# EasyEDA Pro project ProDoc_Home_Automation_Device_2026-02-15.epro

# Schematic Home_Automation_Device

## Sheets
1 Main: Board Name: Home_Automation_Device; Create Date: 2026-02-12; Page Name: Main; Project Name: Home_automation_device; Schematic Name: Home_Automation_Device; Update Date: 2026-02-14; Drawn: SvdM 20260214; Page Size: A4; Reviewed: SvdM 20260214; Version: V1.0
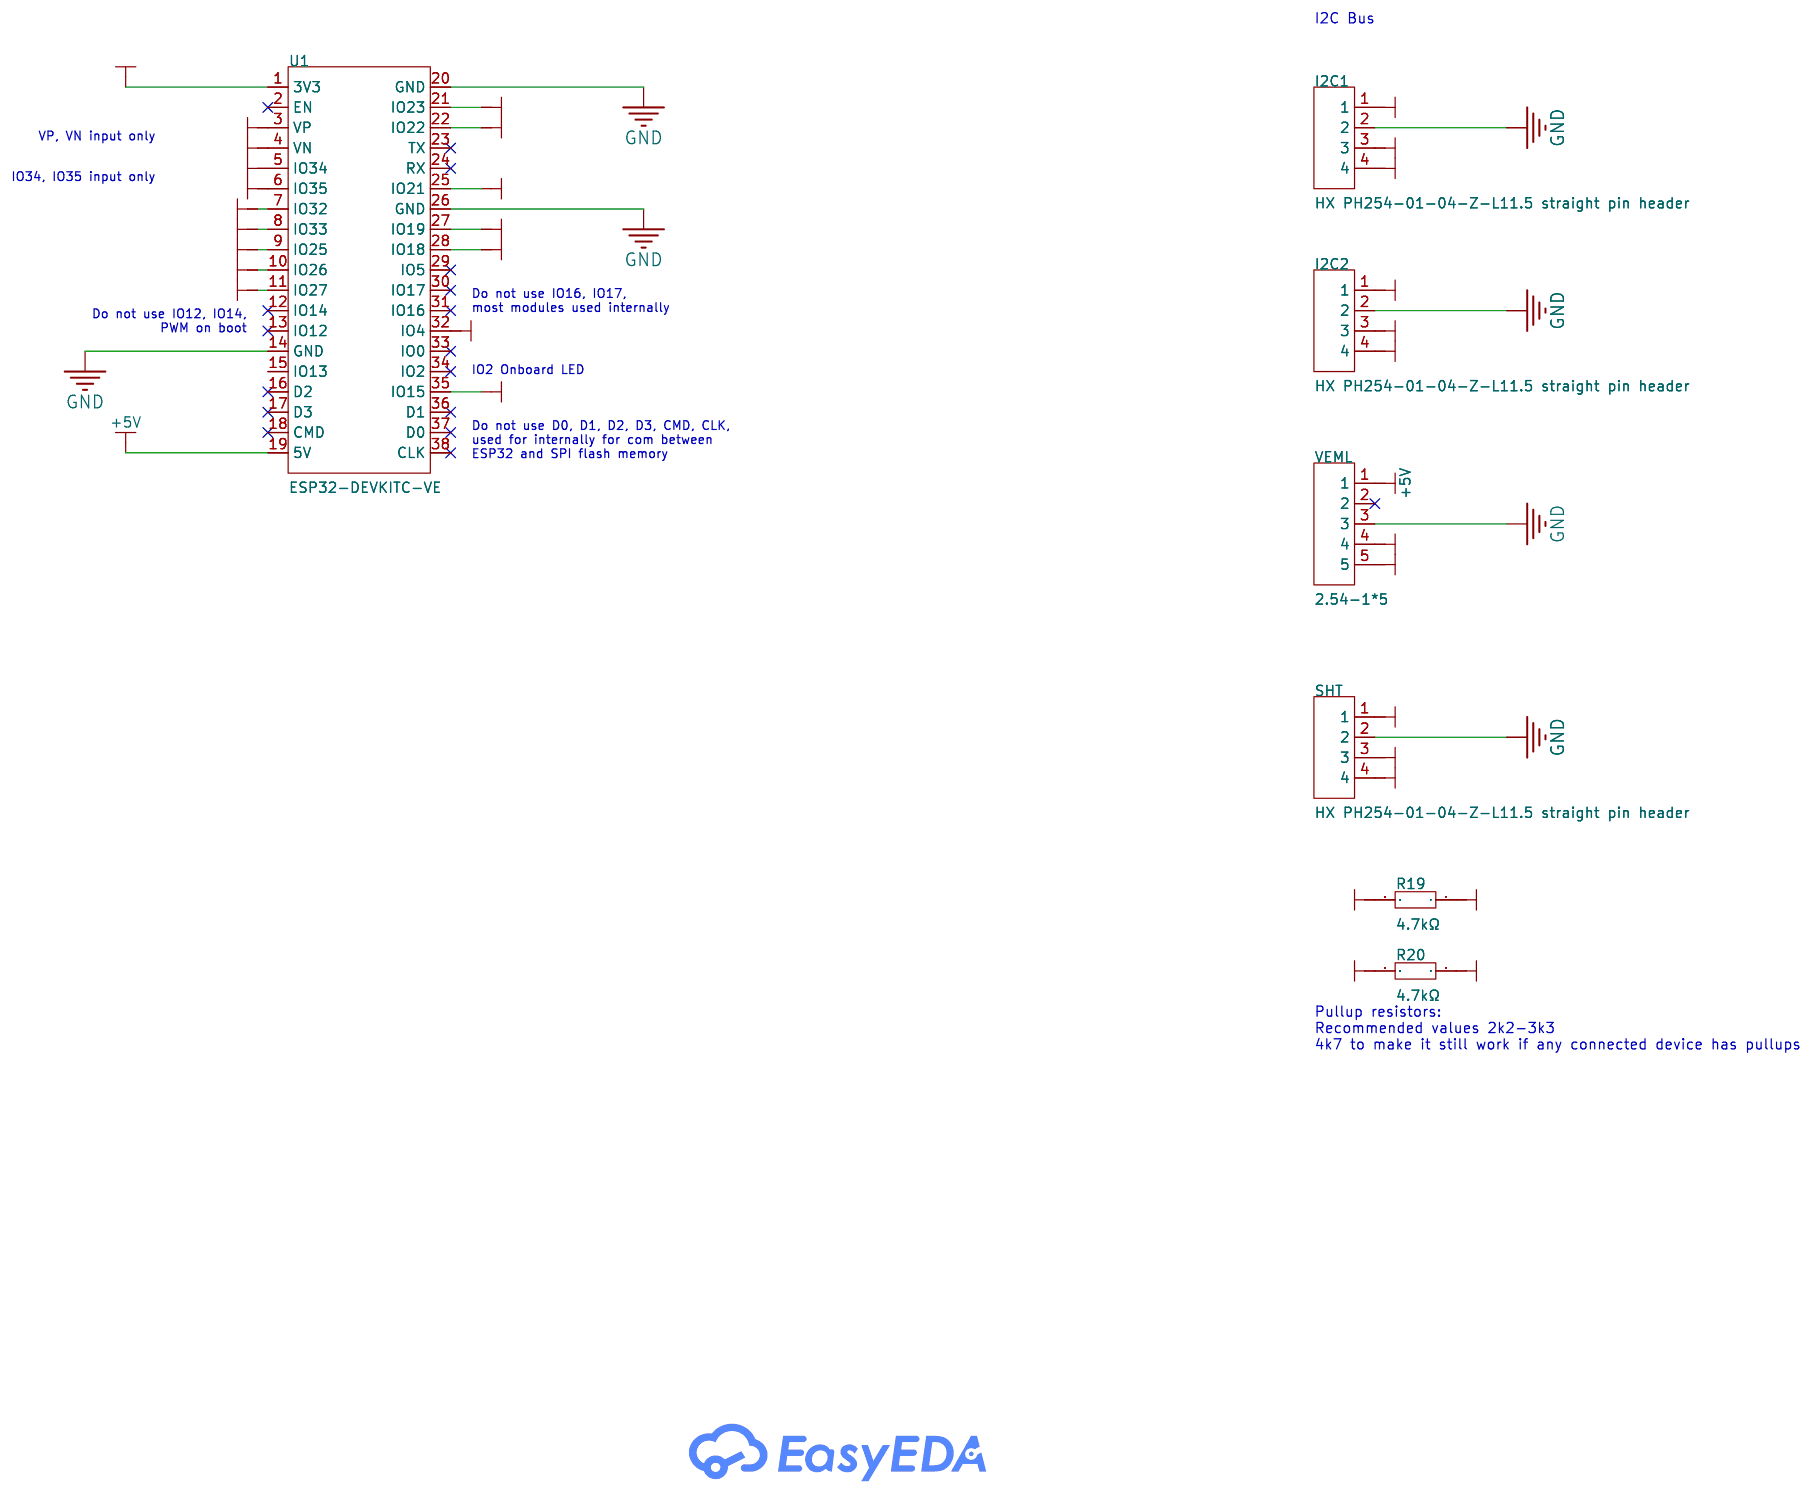
[diagram p0: Main]
2 Input and power: Page Name: Input and power; Update Date: 2026-02-15
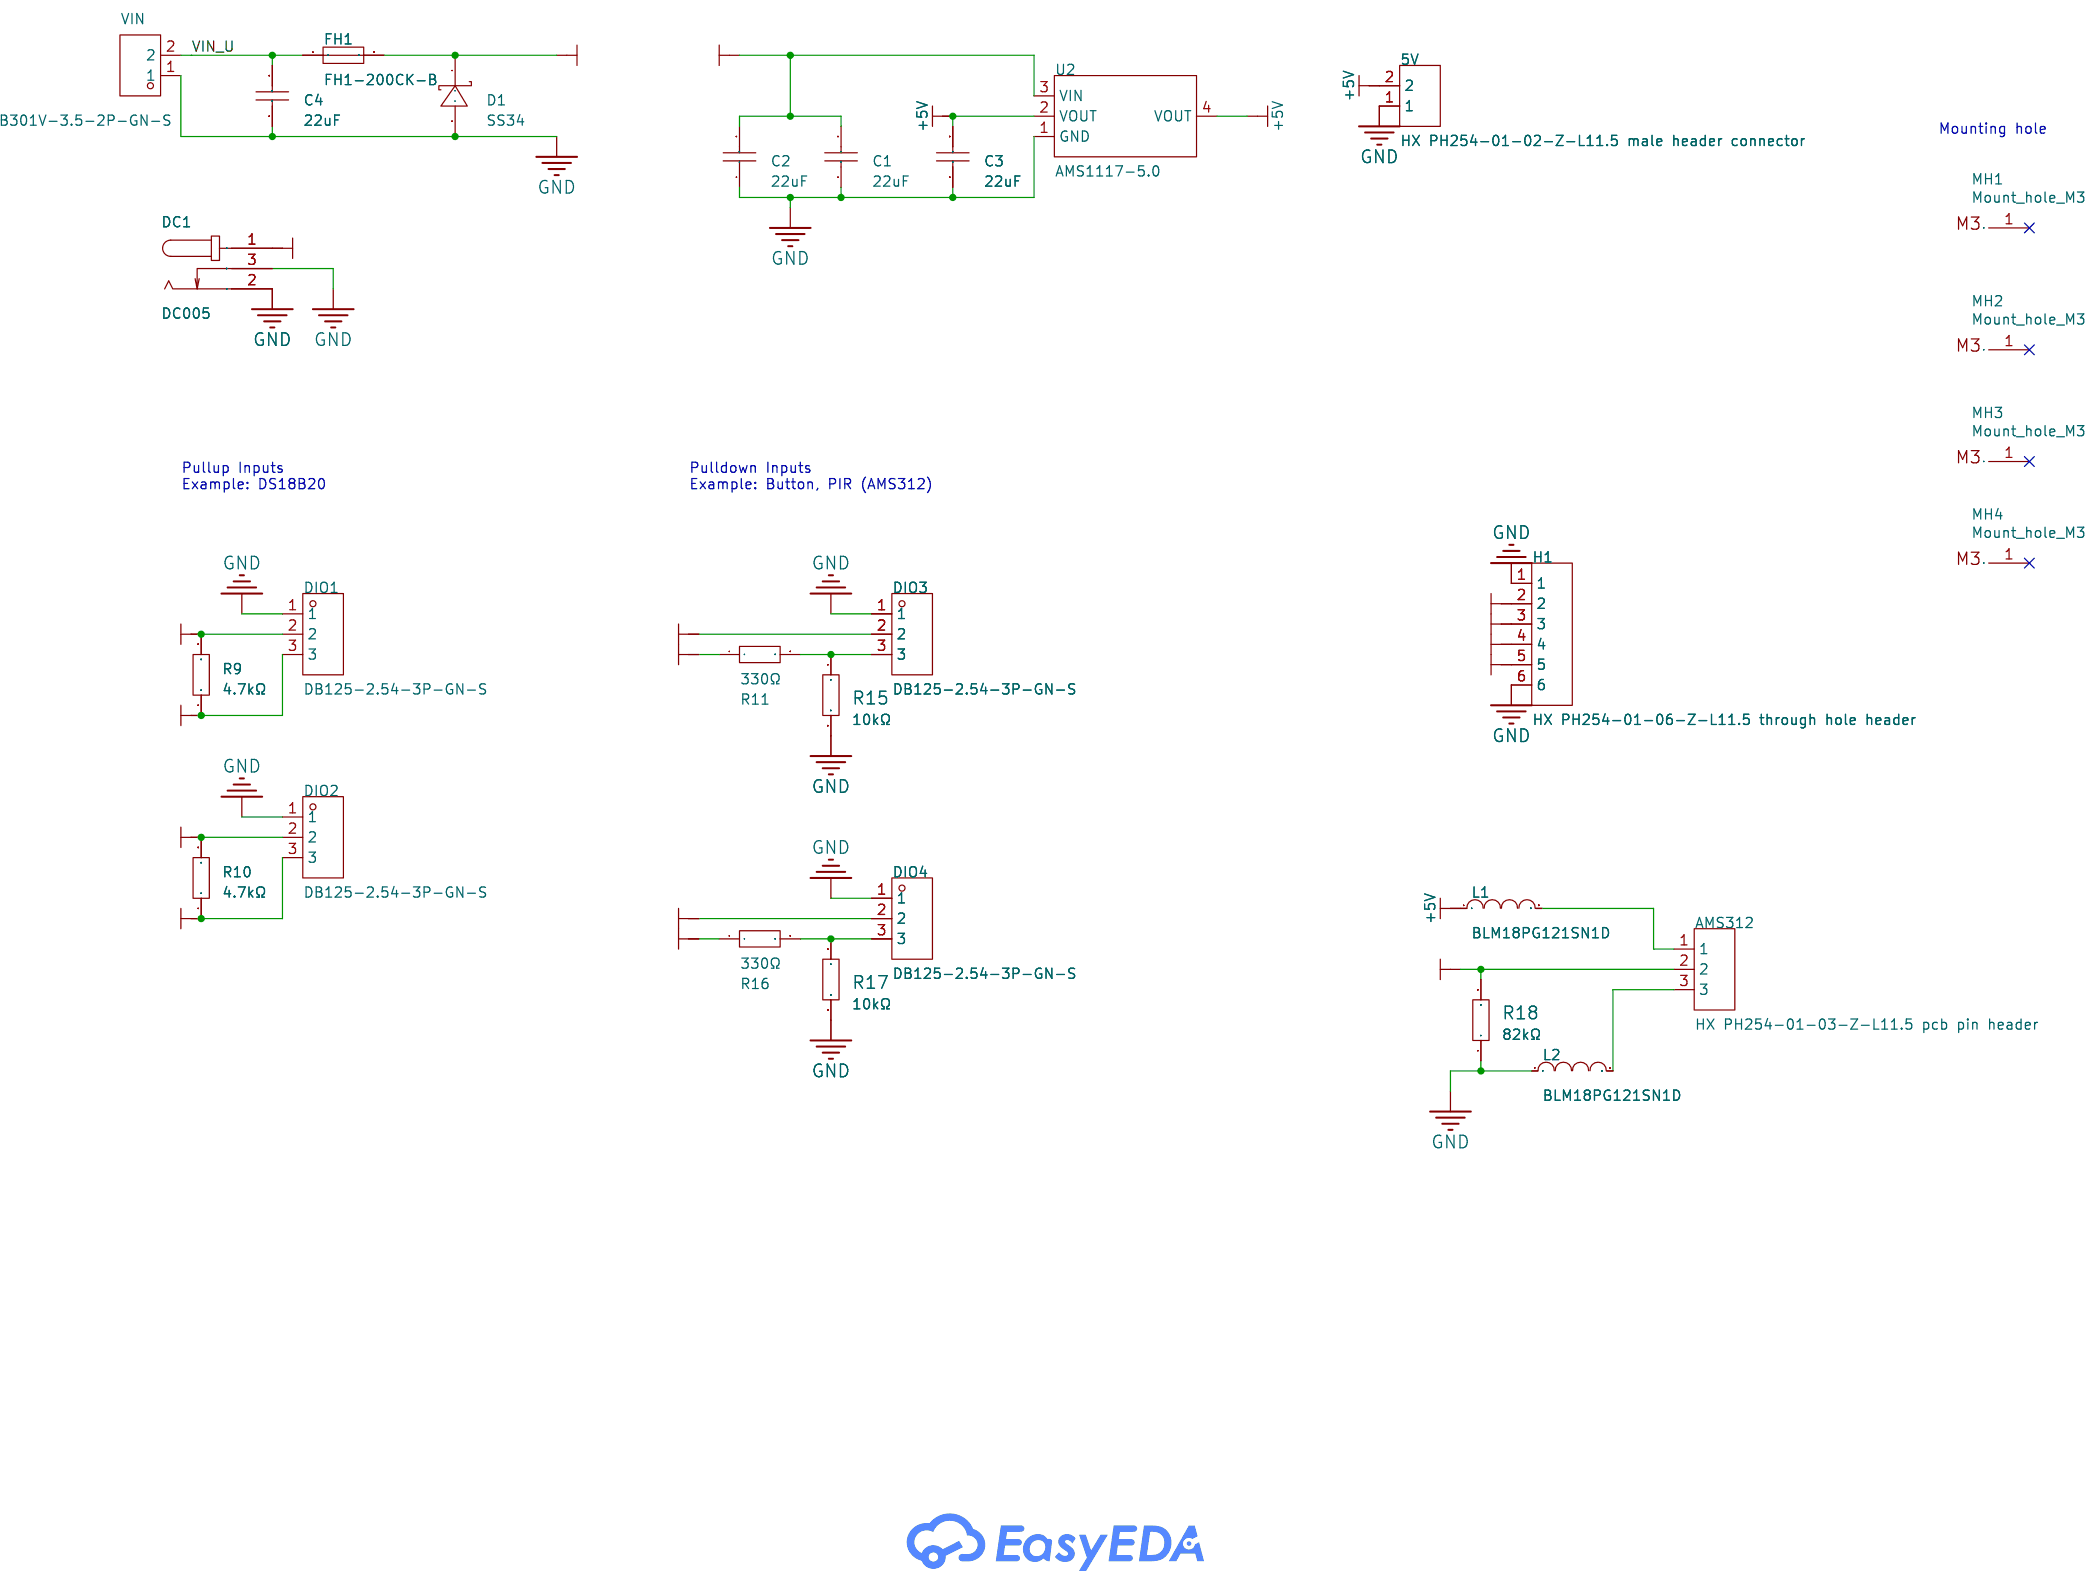
[diagram p1: Input and power]
3 Outputs: Page Name: Outputs; Update Date: 2026-02-15
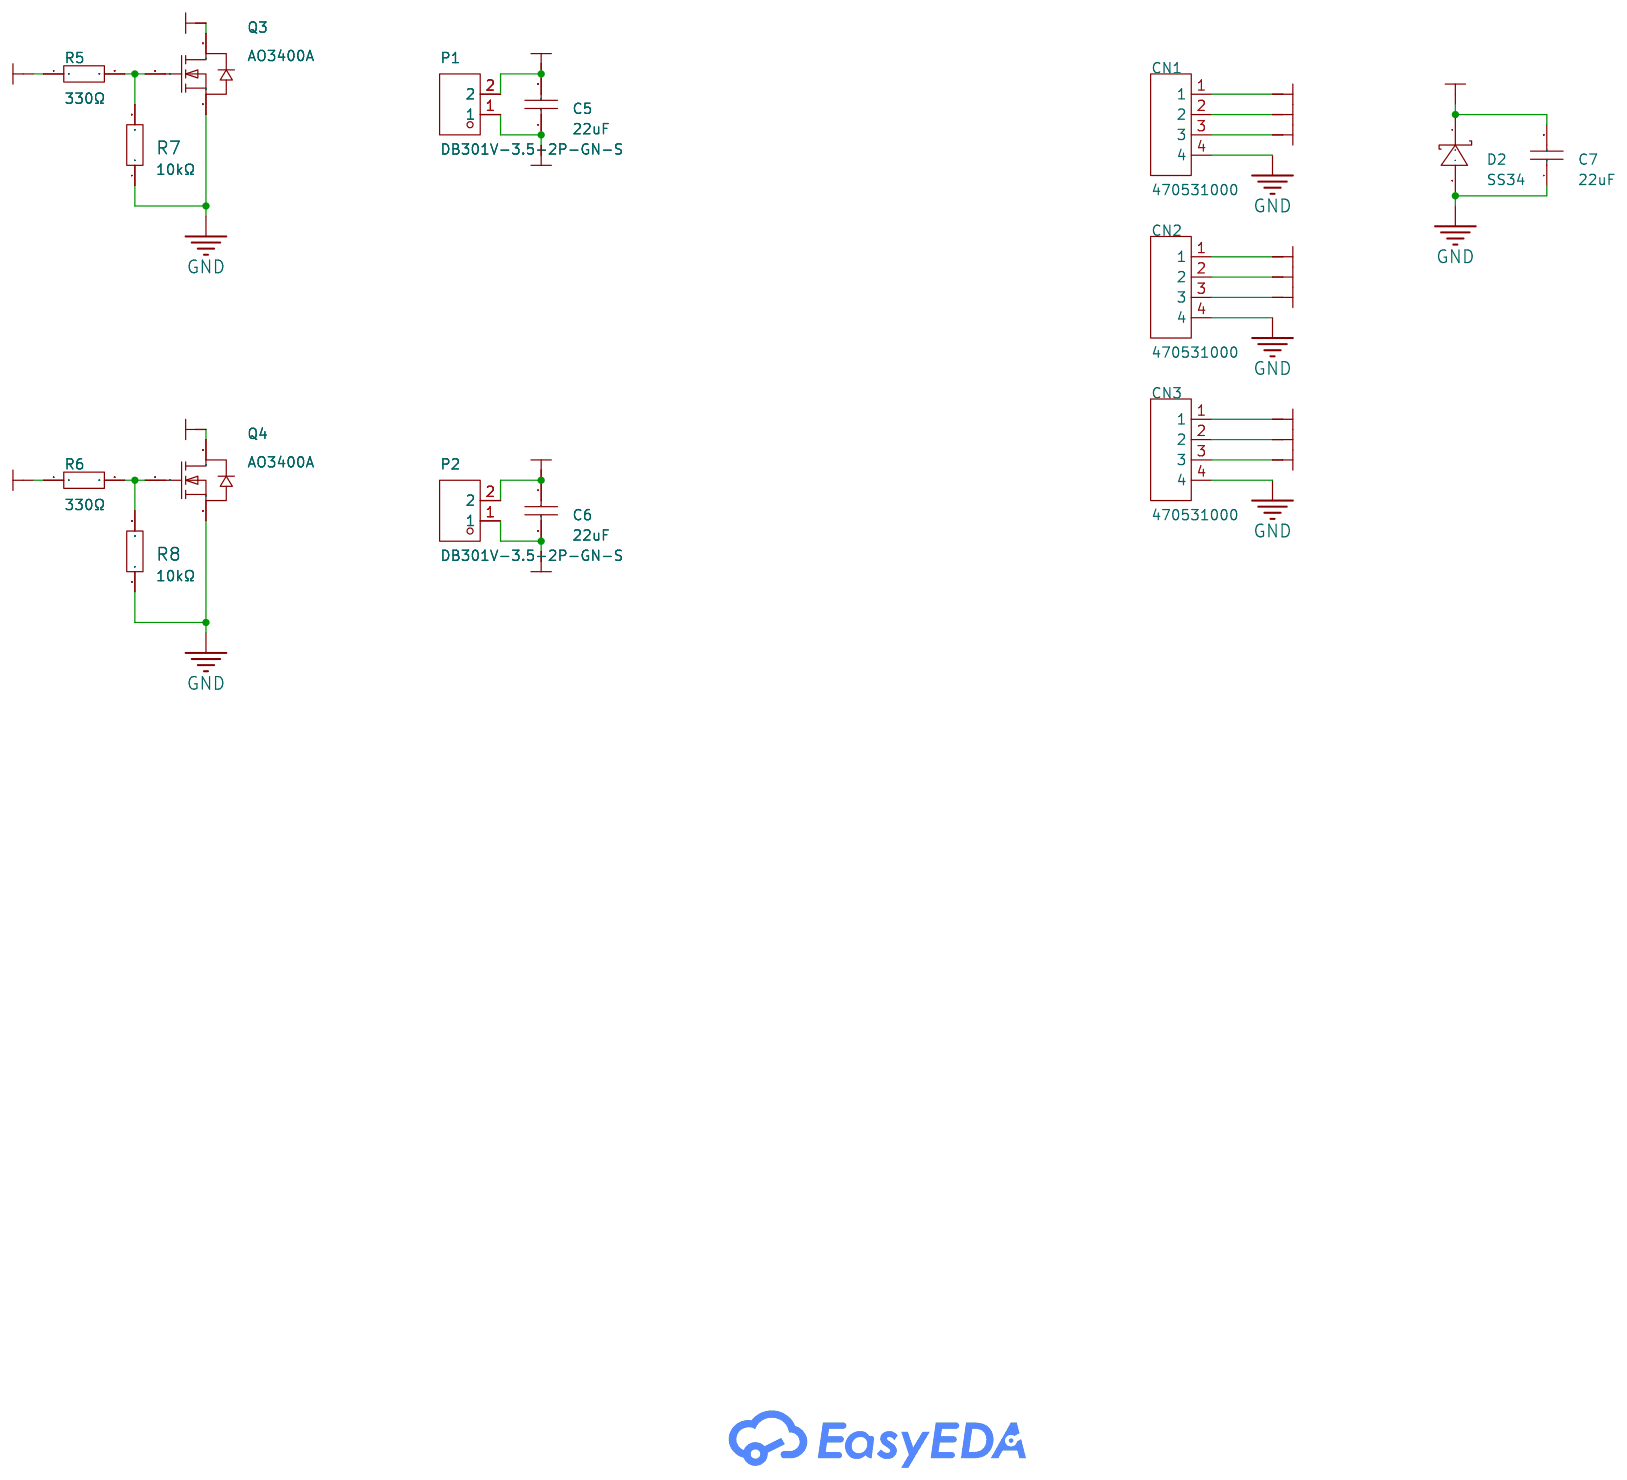
[diagram p2: Outputs]

## Parts
sheet Input and power
5V  HX PH254-01-02-Z-L11.5 male header connector  [HDR-TH_2P-P2.54-V-M]  (no BOM)
AMS312  HX PH254-01-03-Z-L11.5 pcb pin header  [HDR-TH_3P-P2.54-V-M-1]  (no BOM)
C1  22uF  [C1206]
C2  22uF  [C1206]
C3  22uF  [C1206]
C4  22uF  [C1206]
D1  SS34  [SMA_L4.3-W2.6-LS5.2-RD]
DC1  DC005  [DC-IN-TH_DC005]
DIO1  DB125-2.54-3P-GN-S  [CONN-TH_DB125-2.54-3P-GN]
DIO2  DB125-2.54-3P-GN-S  [CONN-TH_DB125-2.54-3P-GN]
DIO3  DB125-2.54-3P-GN-S  [CONN-TH_DB125-2.54-3P-GN]
DIO4  DB125-2.54-3P-GN-S  [CONN-TH_DB125-2.54-3P-GN]
FH1  FH1-200CK-B  [FUSE-TH_L24.8-W9.8-P22.60]
H1  HX PH254-01-06-Z-L11.5 through hole header  [HDR-TH_6P-P2.54-V-M]  (no BOM)
L1  BLM18PG121SN1D  [L0603]
L2  BLM18PG121SN1D  [L0603]
MH1  Mount_hole_M3  [M3_MOUNTING_HOLE_REGULAR]  (no BOM)
MH2  Mount_hole_M3  [M3_MOUNTING_HOLE_REGULAR]  (no BOM)
MH3  Mount_hole_M3  [M3_MOUNTING_HOLE_REGULAR]  (no BOM)
MH4  Mount_hole_M3  [M3_MOUNTING_HOLE_REGULAR]  (no BOM)
R9  4.7kΩ  [R0603]
R10  4.7kΩ  [R0603]
R11  330Ω  [R0603]
R15  10kΩ  [R0603]
R16  330Ω  [R0603]
R17  10kΩ  [R0603]
R18  82kΩ  [R0603]
U2  AMS1117-5.0  [SOT-223_L6.5-W3.5-P2.30-LS7.0-BR]
VIN  DB301V-3.5-2P-GN-S  [CONN-TH_DB301V-3.5-2P-GN]
sheet Main
I2C1  HX PH254-01-04-Z-L11.5 straight pin header  [HDR-TH_4P-HX-PH254-01-04-Z-L11.5]  (no BOM)
I2C2  HX PH254-01-04-Z-L11.5 straight pin header  [HDR-TH_4P-HX-PH254-01-04-Z-L11.5]  (no BOM)
R19  4.7kΩ  [R0603]
R20  4.7kΩ  [R0603]
SHT  HX PH254-01-04-Z-L11.5 straight pin header  [HDR-TH_4P-HX-PH254-01-04-Z-L11.5]  (no BOM)
U1  ESP32-DEVKITC-VE  [BULETM-SMD_ESP32-DEVKITC]
VEML  2.54-1*5  [HDR-TH_5P-P2.54-V-M]  (no BOM)
sheet Outputs
C5  22uF  [C1206]
C6  22uF  [C1206]
C7  22uF  [C1206]
CN1  470531000  [CONN-TH_4P-P2.54_0470531000]
CN2  470531000  [CONN-TH_4P-P2.54_0470531000]
CN3  470531000  [CONN-TH_4P-P2.54_0470531000]
D2  SS34  [SMA_L4.3-W2.6-LS5.2-RD]
P1  DB301V-3.5-2P-GN-S  [CONN-TH_DB301V-3.5-2P-GN]
P2  DB301V-3.5-2P-GN-S  [CONN-TH_DB301V-3.5-2P-GN]
Q3  AO3400A  [SOT-23-3_L2.9-W1.3-P1.90-LS2.4-BR]
Q4  AO3400A  [SOT-23-3_L2.9-W1.3-P1.90-LS2.4-BR]
R5  330Ω  [R0603]
R6  330Ω  [R0603]
R7  10kΩ  [R0603]
R8  10kΩ  [R0603]

## Library data of the parts
5V = HX PH254-01-02-Z-L11.5 male header connector: Pin Structure:1x2P Pitch:2.54mm Circluar Pins/Square Pins:Pin Header Mounting Type:Through Hole Number of Rows:1 Number of Pins:2P Current Rating:3A Voltage Rating (Max):1kV Length of Mating Pin:6mm Insulation Height:2.5mm Length of End Connection Pin:3mm; LCSC Part Name: 1x2P 间距:2.54mm 方针 直插; Supplier Part: C52016390; Manufacturer: hanxia(韩下); Supplier Footprint: 插件,P=2.54mm; JLCPCB Part Class: Extended Part; Datasheet: https://item.szlcsc.com/datasheet/HX%2520PH254-01-02-Z-L11.5%2520male%2520header%2520connector/54760435.html; Supplier: LCSC; Pin Structure: 1x2P; Pitch: 2.54mm; Circluar Pins/Square Pins: Pin Header; Mounting Type: Through Hole; Number of Rows: 1; Number of Pins: 2P; Current Rating: 3A; Voltage Rating (Max): 1kV; Length of Mating Pin: 6mm; Insulation Height: 2.5mm; Length of End Connection Pin: 3mm; Contact Material: Brass; Contact Plating: Gold; Operating Temperature: -40℃~+105℃
AMS312 = HX PH254-01-03-Z-L11.5 pcb pin header: Pin Structure:1x3P Pitch:2.54mm Circluar Pins/Square Pins:Pin Header Mounting Type:Through Hole Number of Rows:1 Number of Pins:3P Current Rating:3A Voltage Rating (Max):1kV Length of Mating Pin:6mm Insulation Height:2.5mm Length of End Connection Pin:3mm; LCSC Part Name: 1x3P 间距:2.54mm 方针 直插; Supplier Part: C52016391; Manufacturer: hanxia(韩下); Supplier Footprint: 插件,P=2.54mm; JLCPCB Part Class: Extended Part; Datasheet: https://item.szlcsc.com/datasheet/HX%2520PH254-01-03-Z-L11.5%2520pcb%2520pin%2520header/54760436.html; Supplier: LCSC; Pin Structure: 1x3P; Pitch: 2.54mm; Circluar Pins/Square Pins: Pin Header; Mounting Type: Through Hole; Number of Rows: 1; Number of Pins: 3P; Current Rating: 3A; Voltage Rating (Max): 1kV; Length of Mating Pin: 6mm; Insulation Height: 2.5mm; Length of End Connection Pin: 3mm; Contact Material: Brass; Contact Plating: Gold; Operating Temperature: -40℃~+105℃
C1-C7 = CL31A226KAHNNNE: Capacitance:22uF Tolerance:±10% Tolerance:±10% Voltage Rating:25V Temperature Coefficient:X5R; LCSC Part Name: 22uF ±10% 25V; Supplier Part: C12891; Manufacturer: SAMSUNG(三星); Supplier Footprint: 1206; JLCPCB Part Class: Basic Part; Datasheet: https://item.szlcsc.com/datasheet/CL31A226KAHNNNE/13537.html; Supplier: LCSC; Tolerance: ±10%; Voltage Rating: 25V; Temperature Coefficient: X5R
D1 D2 = SS34_C8678: Diode Configuration:Independent Voltage - Forward(Vf@If):550mV@3A Voltage - DC Reverse(Vr):40V Current - Rectified:3A Reverse Leakage Current (Ir):500uA@40V Operating Junction Temperature Range:-55℃~+125℃ Operating Junction Temperature Range:-55℃~+125℃; LCSC Part Name: 电压:40V 电流:3A; Supplier Part: C8678; Manufacturer: MDD(辰达半导体); Supplier Footprint: SMA(DO-214AC); JLCPCB Part Class: Basic Part; Datasheet: https://item.szlcsc.com/datasheet/SS34/9178.html; Supplier: LCSC; Diode Configuration: Independent; Voltage - Forward(Vf@If): 550mV@3A; Voltage - DC Reverse(Vr): 40V; Current - Rectified: 3A; Reverse Leakage Current (Ir): 500uA@40V; Operating Junction Temperature Range: -55℃~+125℃
DC1 = DC005: Connector Type:DC Power Jack Mounting Type:Right Angle Inside Contact Diameter:2mm Outside Contact Diameter:6.3mm Current Rating:500mA Voltage Rating (Max):12V Operating Temperature:-30℃~+70℃ Operating Temperature:-30℃~+70℃; LCSC Part Name: DC005-2.0 黑（铁）; Supplier Part: C431533; Manufacturer: SHOU HAN(首韩); Supplier Footprint: 插件; JLCPCB Part Class: Extended Part; Datasheet: https://item.szlcsc.com/datasheet/DC005/427890.html; Supplier: LCSC; Connector Type: DC Power Jack; Mounting Type: Right Angle; Inside Contact Diameter: 2mm; Outside Contact Diameter: 6.3mm; Current Rating: 500mA; Voltage Rating (Max): 12V; Operating Temperature: -30℃~+70℃
DIO1-DIO4 = DB125-2.54-3P-GN-S: Number of Positions or Pins:1x3P Pitch:2.54mm Color:- Mounting Type:Through Hole Number of Pins:3P Number of Rows:1 Number of PINs Per Row:3 Current Rating:7A Voltage Rating (Max):150V Wire Gauge - AWG:18~26 Wire Gauge - AWG:18~26 Wire Gauge - mm2:1 Wire; LCSC Part Name: 1x3P 2.54mm 直插 排数:1 每排P数:3; Supplier Part: C918121; Manufacturer: DORABO(地博电气); Supplier Footprint: 插件,P=2.54mm; JLCPCB Part Class: Extended Part; Datasheet: https://item.szlcsc.com/datasheet/DB125-2.54-3P-GN-S/993700.html; Supplier: LCSC; Number of Positions or Pins: 1x3P; Pitch: 2.54mm; Mounting Type: Through Hole; Number of Pins: 3P; Number of Rows: 1; Number of PINs Per Row: 3; Current Rating: 7A; Voltage Rating (Max): 150V; Wire Gauge - AWG: 18~26; Wire Gauge - mm2: 1; Operating Temperature: -40℃~+105℃
FH1 = FH1-200CK-B: Fuseholder Type:Bracket type Number of Circuits:1 Voltage Rating:250V Current Rating:10A Fuse Type:Cylindrical Fuse Diameter (φD):5mm Fuse Length:20mm; LCSC Part Name: 两件套 保险丝夹5*20黑色（两件套）; Supplier Part: C268205; Manufacturer: HONGJU(宏聚); Supplier Footprint: 插件; JLCPCB Part Class: Extended Part; Datasheet: https://item.szlcsc.com/datasheet/FH1-200CK-B/257712.html; Supplier: LCSC; Fuseholder Type: Bracket type; Number of Circuits: 1; Voltage Rating: 250V; Current Rating: 10A; Fuse Type: Cylindrical; Fuse Diameter (φD): 5mm; Fuse Length: 20mm
H1 = HX PH254-01-06-Z-L11.5 through hole header: Pin Structure:1x6P Pitch:2.54mm Circluar Pins/Square Pins:Pin Header Mounting Type:Through Hole Number of Rows:1 Number of Pins:6P Current Rating:3A Voltage Rating (Max):1kV Length of Mating Pin:6mm Insulation Height:2.5mm Length of End Connection Pin:3mm; LCSC Part Name: 1x6P 间距:2.54mm 方针 直插; Supplier Part: C52016393; Manufacturer: hanxia(韩下); Supplier Footprint: 插件,P=2.54mm; JLCPCB Part Class: Extended Part; Datasheet: https://item.szlcsc.com/datasheet/HX%2520PH254-01-06-Z-L11.5%2520through%2520hole%2520header/54760438.html; Supplier: LCSC; Pin Structure: 1x6P; Pitch: 2.54mm; Circluar Pins/Square Pins: Pin Header; Mounting Type: Through Hole; Number of Rows: 1; Number of Pins: 6P; Current Rating: 3A; Voltage Rating (Max): 1kV; Length of Mating Pin: 6mm; Insulation Height: 2.5mm; Length of End Connection Pin: 3mm; Contact Material: Brass; Contact Plating: Gold; Operating Temperature: -40℃~+105℃
L1 L2 = BLM18PG121SN1D_C14709: Impedance @ Frequency:120Ω@100MHz Tolerance:±25% Tolerance:±25% DC Resistance:50mΩ Current Rating:2A Circuits:1; LCSC Part Name: 单路 0603磁珠 阻抗120Ω@100MHz; Supplier Part: C14709; Manufacturer: muRata(村田); Supplier Footprint: 0603; JLCPCB Part Class: Basic Part; Datasheet: https://atta.szlcsc.com/upload/public/pdf/source/20130704/1457706621422.pdf; Supplier: LCSC; Impedance @ Frequency: 120Ω@100MHz; Tolerance: ±25%; DC Resistance: 50mΩ; Current Rating: 2A; Circuits: 1
MH1-MH4 = Mount_hole_M3: Supplier Part: nopart; Contributor: sjvdmarel; spicePre: M
R9 R10 R19 R20 = 0603WAF4701T5E: Type:Thick Film Resistor Resistance:4.7kΩ Tolerance:±1% Tolerance:±1% Power(Watts):100mW Voltage-Supply(Max):75V Temperature Coefficient:±100ppm/℃ Temperature Coefficient:±100ppm/℃ Operating Temperature:-55℃~+155℃ Operating Temperature:-55℃~+155℃; LCSC Part Name: 4.7kΩ ±1% 100mW 厚膜电阻; Supplier Part: C23162; Manufacturer: UNI-ROYAL(厚声); Supplier Footprint: 0603; JLCPCB Part Class: Basic Part; Datasheet: https://item.szlcsc.com/datasheet/0603WAF4701T5E/23889.html; Supplier: LCSC; Type: Thick Film Resistor; Tolerance: ±1%; Power(Watts): 100mW; Voltage-Supply(Max): 75V; Temperature Coefficient: ±100ppm/℃; Operating Temperature: -55℃~+155℃
R5 R6 R11 R16 = 0603WAF3300T5E: Type:Thick Film Resistors Resistance: Tolerance:±1% Tolerance:±1% Power(Watts): Overload Voltage (Max): Temperature Coefficient:±100ppm/℃ Temperature Coefficient:±100ppm/℃ Operating Temperature Range:-55℃~+155℃ Operating Temperature Range:-55℃~+155℃; LCSC Part Name: 330Ω ±1% 100mW 厚膜电阻; Supplier Part: C23138; Manufacturer: UNI-ROYAL(厚声); Supplier Footprint: 0603; JLCPCB Part Class: Basic Part; Datasheet: https://atta.szlcsc.com/upload/public/pdf/source/20200306/C422600_1E6D84923E4A46A82E41ADD87F860B5C.pdf; Supplier: LCSC; Type: Thick Film Resistors; Tolerance: ±1%; Temperature Coefficient: ±100ppm/℃; Operating Temperature Range: -55℃~+155℃
R7 R8 R15 R17 = 0603WAF1002T5E: Type:Thick Film Resistor Resistance:10kΩ Tolerance:±1% Tolerance:±1% Power(Watts):100mW Voltage-Supply(Max):75V Temperature Coefficient:±100ppm/℃ Temperature Coefficient:±100ppm/℃ Operating Temperature:-55℃~+155℃ Operating Temperature:-55℃~+155℃; LCSC Part Name: 厚膜电阻 10kΩ ±1% 100mW; Supplier Part: C25804; Manufacturer: UNI-ROYAL(厚声); Supplier Footprint: 0603; JLCPCB Part Class: Basic Part; Datasheet: https://item.szlcsc.com/datasheet/0603WAF1002T5E/26547.html; Supplier: LCSC; Type: Thick Film Resistor; Tolerance: ±1%; Power(Watts): 100mW; Voltage-Supply(Max): 75V; Temperature Coefficient: ±100ppm/℃; Operating Temperature: -55℃~+155℃
R18 = 0603WAF8202T5E: Type:Thick Film Resistor Resistance:82kΩ Tolerance:±1% Tolerance:±1% Power(Watts):100mW Voltage-Supply(Max):75V Temperature Coefficient:±100ppm/℃ Temperature Coefficient:±100ppm/℃ Operating Temperature:-55℃~+155℃ Operating Temperature:-55℃~+155℃; LCSC Part Name: 82kΩ ±1% 100mW 厚膜电阻; Supplier Part: C23254; Manufacturer: UNI-ROYAL(厚声); Supplier Footprint: 0603; JLCPCB Part Class: Basic Part; Datasheet: https://item.szlcsc.com/datasheet/0603WAF8202T5E/23981.html; Supplier: LCSC; Type: Thick Film Resistor; Tolerance: ±1%; Power(Watts): 100mW; Voltage-Supply(Max): 75V; Temperature Coefficient: ±100ppm/℃; Operating Temperature: -55℃~+155℃
U2 = AMS1117-5.0_C6187: Output Type:Fixed Voltage - Supply:15V Output Voltage:5V Output Voltage:5V Output Current:1A Power Supply Rejection Ratio (PSRR):60dB Voltage Dropout:1.3V standby current:- Noise:- Features:- Operating Temperature:-40℃~+125℃ Operating Temperature:-40℃~+12; LCSC Part Name: 输入15V 输出5V 1A; Supplier Part: C6187; Manufacturer: AMS; Supplier Footprint: SOT-223; JLCPCB Part Class: Basic Part; Datasheet: https://item.szlcsc.com/datasheet/AMS1117-5.0/6653.html; Supplier: LCSC; Output Type: Fixed; Voltage - Supply: 15V; Output Voltage: 5V; Output Current: 1A; Power Supply Rejection Ratio (PSRR): 60dB; Voltage Dropout: 1.3V; Operating Temperature: -40℃~+125℃; Output Configuration: Positive; Number of Outputs: 1
P1 P2 VIN = DB301V-3.5-2P-GN-S: Number of Positions or Pins:1x2P Pitch:3.5mm Color:Green Mounting Type:Through Hole Number of Pins:2P Number of Rows:1 Number of PINs Per Row:2 Screw Specification:M2 Current Rating:7A Voltage Rating (Max):300V Wire Gauge - AWG:18~24 Wire Gauge - AWG:18~2; LCSC Part Name: 1x2P 3.5mm 直插 排数:1 每排P数:2; Supplier Part: C695629; Manufacturer: DORABO(地博电气); Supplier Footprint: 插件,P=3.5mm; JLCPCB Part Class: Extended Part; Datasheet: https://item.szlcsc.com/datasheet/DB301V-3.5-2P-GN-S/728965.html; Supplier: LCSC; Number of Positions or Pins: 1x2P; Pitch: 3.5mm; Color: Green; Mounting Type: Through Hole; Number of Pins: 2P; Number of Rows: 1; Number of PINs Per Row: 2; Screw Specification: M2; Current Rating: 7A; Voltage Rating (Max): 300V; Wire Gauge - AWG: 18~24; Wire Gauge - mm2: 0.5~1; Operating Temperature: -40℃~+105℃
I2C1 I2C2 SHT = HX PH254-01-04-Z-L11.5 straight pin header: Pin Structure:1x4P Pitch:2.54mm Circluar Pins/Square Pins:Pin Header Mounting Type:Through Hole Number of Rows:1 Number of Pins:4P Current Rating:3A Voltage Rating (Max):1kV Length of Mating Pin:6mm Insulation Height:2.5mm Length of End Connection Pin:3mm; LCSC Part Name: 1x4P 间距:2.54mm 方针 直插; Supplier Part: C52016392; Manufacturer: hanxia(韩下); Supplier Footprint: 插件,P=2.54mm; JLCPCB Part Class: Extended Part; Datasheet: https://item.szlcsc.com/datasheet/HX%2520PH254-01-04-Z-L11.5%2520straight%2520pin%2520header/54760437.html; Supplier: LCSC; Pin Structure: 1x4P; Pitch: 2.54mm; Circluar Pins/Square Pins: Pin Header; Mounting Type: Through Hole; Number of Rows: 1; Number of Pins: 4P; Current Rating: 3A; Voltage Rating (Max): 1kV; Length of Mating Pin: 6mm; Insulation Height: 2.5mm; Length of End Connection Pin: 3mm; Contact Material: Brass; Contact Plating: Gold; Operating Temperature: -40℃~+105℃
U1 = ESP32-DEVKITC-VE: Supplier Part: C20437001; Manufacturer: ESPRESSIF(乐鑫); JLCPCB Part Class: Extended Part; Datasheet: https://item.szlcsc.com/datasheet/ESP32-DEVKITC-VE/21775466.html; Supplier: LCSC
VEML = 2.54-1*5: Pin Structure:1x5P Pitch:2.54mm Circluar Pins/Square Pins:Pin Header Mounting Type:Through Hole Number of Rows:1 Number of Pins:5P Current Rating:2.5A Length of Mating Pin:6mm Insulation Height:2.54mm Length of End Connection Pin:3mm Contact Material:Bras; LCSC Part Name: 1x5P 间距:2.54mm 方针 直插; Supplier Part: C5156614; Manufacturer: ZHOURI(洲日); Supplier Footprint: 插件,P=2.54mm; JLCPCB Part Class: Extended Part; Datasheet: https://item.szlcsc.com/datasheet/2.54-1*5/5790714.html; Supplier: LCSC; Pin Structure: 1x5P; Pitch: 2.54mm; Circluar Pins/Square Pins: Pin Header; Mounting Type: Through Hole; Number of Rows: 1; Number of Pins: 5P; Current Rating: 2.5A; Length of Mating Pin: 6mm; Insulation Height: 2.54mm; Length of End Connection Pin: 3mm; Contact Material: Brass; Contact Plating: Gold; Operating Temperature: -40℃~+105℃
CN1-CN3 = 470531000_C3025061: Pins Structure:1x4P Pitch:2.54mm Mounting Type:Through Hole Number of Pins:4P Number of Rows:1 Number of PINs Per Row:4 Current Rating:4A Contact Material:Copper Alloy Contact Plating:Tin Voltage Rating:500V Plastic Material:PA Flame Retardant Rating:UL94; LCSC Part Name: 1x4P 间距:2.54mm 直插; Supplier Part: C3025061; Manufacturer: MOLEX; Supplier Footprint: 插件,P=2.54mm; JLCPCB Part Class: Extended Part; Datasheet: https://www.molex.com/content/dam/molex/molex-dot-com/products/automated/en-us/salesdrawingpdf/470/47053/470531000_sd.pdf?inline; Supplier: LCSC; Pins Structure: 1x4P; Pitch: 2.54mm; Mounting Type: Through Hole; Number of Pins: 4P; Number of Rows: 1; Number of PINs Per Row: 4; Current Rating: 4A; Contact Material: Copper Alloy; Contact Plating: Tin; Voltage Rating: 500V; Plastic Material: PA; Flame Retardant Rating: UL94V-0; Color: White; X-Length of Bottom Edge on Board (Spacing Line): 10.2mm
Q3 Q4 = AO3400A_C20917: Number:- Drain to Source Voltage:30V Current - Continuous Drain(Id):- RDS(on):48mΩ@2.5V Pd - Power Dissipation:- Gate Threshold Voltage (Vgs(th)):1.45V@250uA Gate Charge(Qg):7nC@10V Input Capacitance(Ciss):630pF@15V Reverse Transfer Capacitance (Crss@Vds); LCSC Part Name: 1个N沟道 耐压:30V 电流:5.7A; Supplier Part: C20917; Manufacturer: AOS; Supplier Footprint: SOT-23-3L; JLCPCB Part Class: Basic Part; Datasheet: https://item.szlcsc.com/datasheet/AO3400A/21629.html; Supplier: LCSC; Drain to Source Voltage: 30V; RDS(on): 48mΩ@2.5V; Gate Threshold Voltage (Vgs(th)): 1.45V@250uA; Gate Charge(Qg): 7nC@10V; Input Capacitance(Ciss): 630pF@15V; Operating Temperature: -55℃~+150℃@(Tj); Type: N-Channel

## Nets
+3V3: DIO1.2 DIO2.2 DIO3.2 DIO4.2 H1.5 I2C1.1 I2C2.1 R9.2 R10.2 R19.2 R20.2 SHT.1 U1.1(3V3)
+5V: 5V.2 C3.2 L1.1 U1.19(5V) U2.2(VOUT) U2.4(VOUT) VEML.1
GND: 5V.1 C1.1 C2.1 C3.1 C4.1 C7.1 CN1.4 CN2.4 CN3.4 D1.2(A) D2.2(A) DC1.2 DC1.3 DIO1.1 DIO2.1 DIO3.1 DIO4.1 H1.1 H1.6 I2C1.2 I2C2.2 L2.1 Q3.2(S) Q4.2(S) R7.1 R8.1 R15.2 R17.2 R18.1 SHT.2 U1.14(GND) U1.20(GND) U1.26(GND) U2.1(GND) VEML.3 VIN.1
VIN: C1.2 C2.2 C5.2 C6.2 C7.2 CN1.3 CN2.3 CN3.3 D1.1(K) D2.1(K) FH1.2 P1.2 P2.2 U2.3(VIN)
VIN_U: C4.2 DC1.1 FH1.1 VIN.2
DI_AMS: AMS312.2 R18.2 U1.5(IO34)
DIO1S: DIO1.3 R9.1 U1.7(IO32)
DIO2S: DIO2.3 R10.1 U1.8(IO33)
DIO3S: R11.1 U1.21(IO23)
DIO4S: R16.1 U1.35(IO15)
EXP2: H1.2 U1.6(IO35)
EXP3: H1.3 U1.3(VP)
EXP4: H1.4 U1.4(VN)
FAN_FB1: CN1.2 U1.9(IO25)
FAN_FB2: CN2.2 U1.10(IO26)
FAN_FB3: CN3.2 U1.11(IO27)
FAN_PWM: CN1.1 CN2.1 CN3.1 U1.32(IO4)
P1P: C5.1 P1.1 Q3.3(D)
P1S: R5.1 U1.28(IO18)
P2P: C6.1 P2.1 Q4.3(D)
P2S: R6.1 U1.27(IO19)
SCL: I2C1.3 I2C2.3 R19.1 SHT.3 U1.22(IO22) VEML.4
SDA: I2C1.4 I2C2.4 R20.1 SHT.4 U1.25(IO21) VEML.5
$2N2877: DIO3.3 R11.2 R15.1
$2N3321: DIO4.3 R16.2 R17.1
$2N5972: AMS312.1 L1.2
$2N6228: AMS312.3 L2.2
$4N422: Q3.1(G) R5.2 R7.2
$4N423: Q4.1(G) R6.2 R8.2

Not connected (* = marked no-connect by the designer): MH1 1*; MH2 1*; MH3 1*; MH4 1*; U1 2(EN)* 12(IO14)* 13(IO12)* 15(IO13) 16(D2)* 17(D3)* 18(CMD)* 23(TX)* 24(RX)* 29(IO5)* 30(IO17)* 31(IO16)* 33(IO0)* 34(IO2)* 36(D1)* 37(D0)* 38(CLK)*; VEML 2*

## Notes on the sheets
sheet 1
- I2C Bus
- VP, VN input only
- IO34, IO35 input only
- Do not use IO16, IO17,
  most modules used internally
- Do not use IO12, IO14,
  PWM on boot
- IO2 Onboard LED
- Do not use D0, D1, D2, D3, CMD, CLK,
  used for internally for com between
  ESP32 and SPI flash memory
- Pullup resistors:
  Recommended values 2k2-3k3
  4k7 to make it still work if any connected device has pullups
sheet 2
- Mounting hole
- Pullup Inputs
  Example: DS18B20
- Pulldown Inputs
  Example: Button, PIR (AMS312)

# Board PCB1
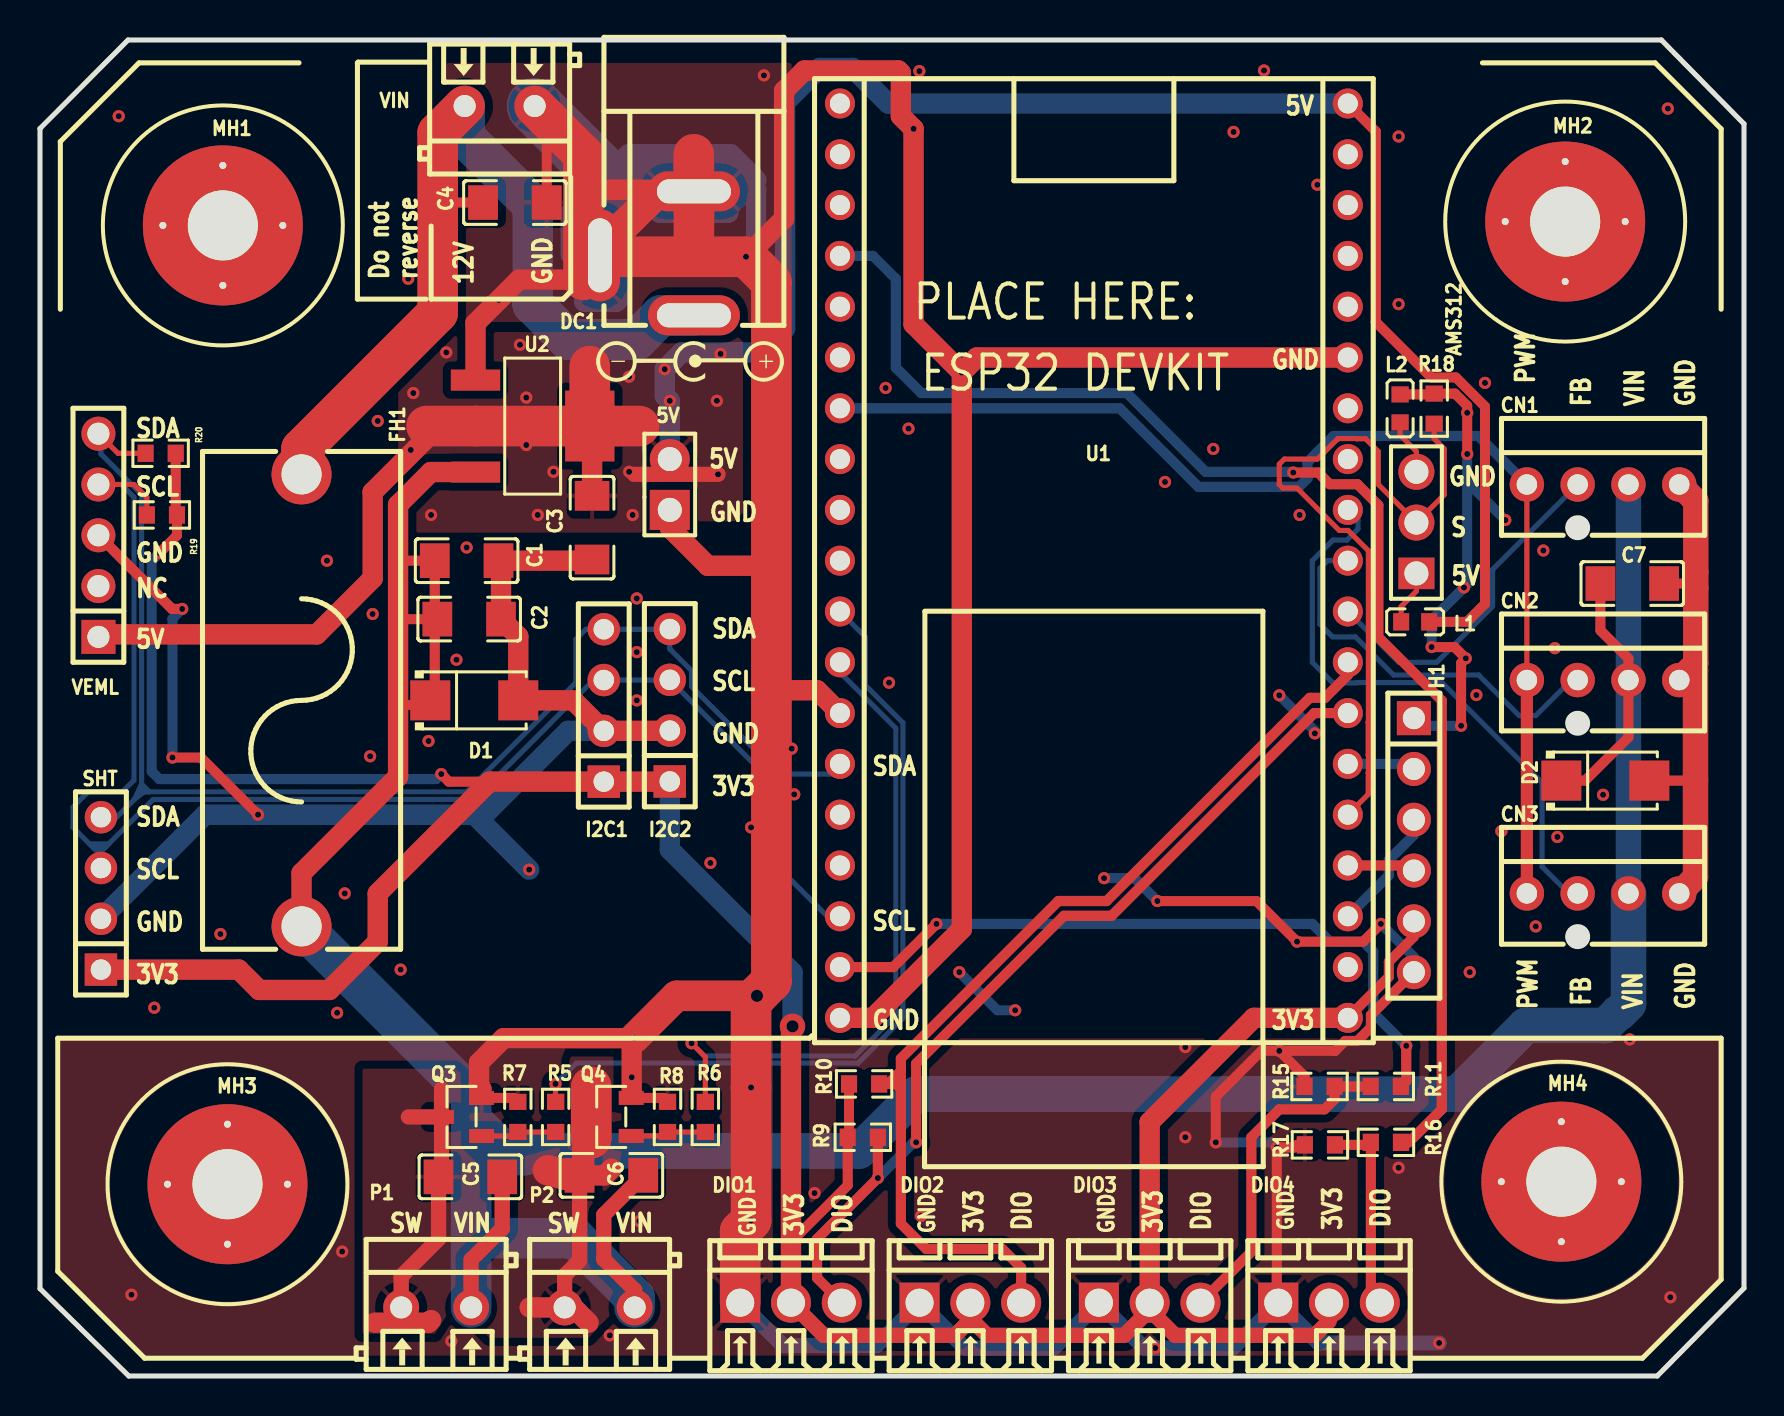
[diagram p3: board, top side]
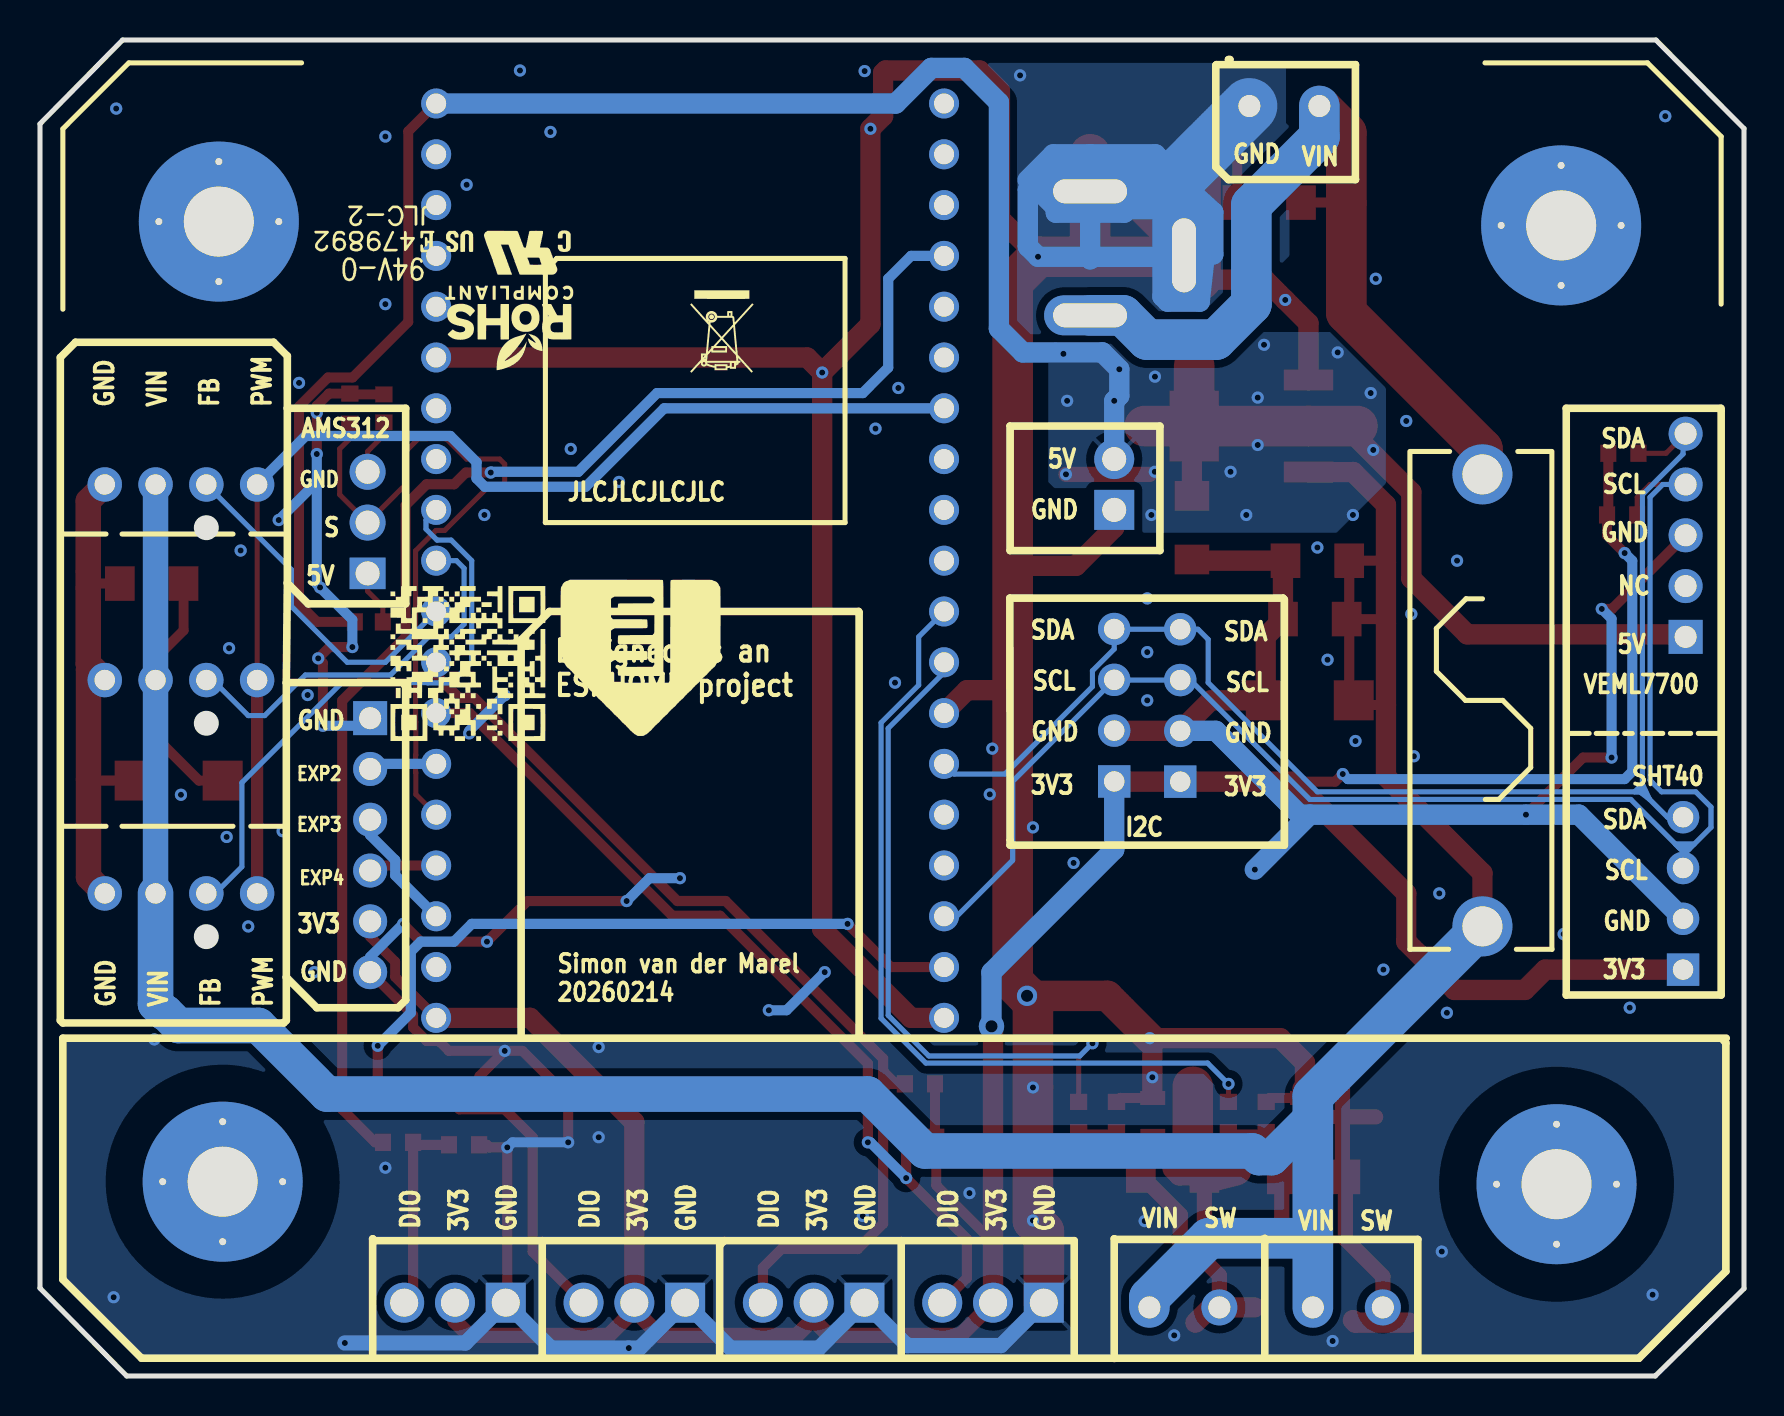
[diagram p4: board, bottom side, seen from below]

Outline 85.22 x 66.8 mm; copper layers: Top Layer, Bottom Layer. Coordinates in mm from the lower left corner of the outline.
Outline path: 0,62.37 4.4,66.8 81.08,66.8 85.22,62.61 85.22,4.39 80.88,0 4.44,0 0,4.37 0,62.37
Stack: Top Layer 0.035mm / Dielectric1 1.51mm FR4 er 4.5 / Bottom Layer 0.035mm

## Design rules (mm)
template: Custom Config
spacing copperThickness1oz (default): track to track 0.102, other pairs 0.152 to 0.3
spacing copperThickness2oz: track to track 0.203, other pairs 0.152 to 0.3
spacing StayAway: track to track 2, other pairs 0.152 to 0.3
track width copperThickness1oz (default): min 0.127, default 0.254, max 2.54
track width copperThickness2oz: min 0.203, default 0.254, max 2.54
track width VIN: min 0.4, default 0.5, max 2.54
differential pair differentialPair (default): width min 0.127, default 0.254, max 2.54; gap min 0.152, default 0.152
via viaSize (default): diameter min 0.5, default 0.61, max 10; hole min 0.3, default 0.305, max 6.3
net GND uses VIN
net +5V uses VIN
net VIN uses VIN
net +3V3 uses VIN
net VIN_U uses VIN

## Placement (name value [footprint] x y rotation side)
5V  HX PH254-01-02-Z-L11.5 male header connector  [HDR-TH_2P-P2.54-V-M]  31.5 44.58 90 top
AMS312  HX PH254-01-03-Z-L11.5 pcb pin header  [HDR-TH_3P-P2.54-V-M-1]  68.83 42.67 90 top
C1  22uF  [C1206]  21.34 40.77 180 top
C2  22uF  [C1206]  21.46 37.85 180 top
C3  22uF  [C1206]  27.61 42.42 90 top
C4  22uF  [C1206]  23.75 58.67 180 top
C5  22uF  [C1206]  21.52 9.96 0 top
C6  22uF  [C1206]  28.58 10.03 0 top
C7  22uF  [C1206]  79.63 39.62 180 top
CN1  470531000  [CONN-TH_4P-P2.54_0470531000]  78.17 44.58 0 top
CN2  470531000  [CONN-TH_4P-P2.54_0470531000]  78.17 34.8 0 top
CN3  470531000  [CONN-TH_4P-P2.54_0470531000]  78.17 24.13 0 top
D1  SS34  [SMA_L4.3-W2.6-LS5.2-RD]  21.72 33.78 0 top
D2  SS34  [SMA_L4.3-W2.6-LS5.2-RD]  78.28 29.77 0 top
DC1  DC005  [DC-IN-TH_DC005]  30.35 56.13 270 top
DIO1  DB125-2.54-3P-GN-S  [CONN-TH_DB125-2.54-3P-GN]  37.56 3.67 0 top
DIO2  DB125-2.54-3P-GN-S  [CONN-TH_DB125-2.54-3P-GN]  46.53 3.67 0 top
DIO3  DB125-2.54-3P-GN-S  [CONN-TH_DB125-2.54-3P-GN]  55.49 3.67 0 top
DIO4  DB125-2.54-3P-GN-S  [CONN-TH_DB125-2.54-3P-GN]  64.46 3.67 0 top
FH1  FH1-200CK-B  [FUSE-TH_L24.8-W9.8-P22.60]  13.08 33.78 270 top
H1  HX PH254-01-06-Z-L11.5 through hole header  [HDR-TH_6P-P2.54-V-M]  68.71 26.54 270 top
I2C1  HX PH254-01-04-Z-L11.5 straight pin header  [HDR-TH_4P-HX-PH254-01-04-Z-L11.5]  28.19 33.53 90 top
I2C2  HX PH254-01-04-Z-L11.5 straight pin header  [HDR-TH_4P-HX-PH254-01-04-Z-L11.5]  31.5 33.54 90 top
L1  BLM18PG121SN1D  [L0603]  68.77 37.71 180 top
L2  BLM18PG121SN1D  [L0603]  68.02 48.38 270 top
MH1  Mount_hole_M3  [M3_MOUNTING_HOLE_REGULAR]  9.14 57.53 0 top
MH2  Mount_hole_M3  [M3_MOUNTING_HOLE_REGULAR]  76.27 57.72 0 top
MH3  Mount_hole_M3  [M3_MOUNTING_HOLE_REGULAR]  9.38 9.59 0 top
MH4  Mount_hole_M3  [M3_MOUNTING_HOLE_REGULAR]  76.08 9.72 0 top
P1  DB301V-3.5-2P-GN-S  [CONN-TH_DB301V-3.5-2P-GN]  19.81 3.43 0 top
P2  DB301V-3.5-2P-GN-S  [CONN-TH_DB301V-3.5-2P-GN]  27.99 3.43 0 top
Q3  AO3400A  [SOT-23-3_L2.9-W1.3-P1.90-LS2.4-BR]  21.08 12.95 0 top
Q4  AO3400A  [SOT-23-3_L2.9-W1.3-P1.90-LS2.4-BR]  28.57 12.95 0 top
R5  330Ω  [R0603]  25.79 12.95 270 top
R6  330Ω  [R0603]  33.27 12.95 270 top
R7  10kΩ  [R0603]  23.9 12.95 270 top
R8  10kΩ  [R0603]  31.38 12.95 270 top
R9  4.7kΩ  [R0603]  41.15 11.94 180 top
R10  4.7kΩ  [R0603]  41.21 14.6 180 top
R11  330Ω  [R0603]  67.3 14.48 180 top
R15  10kΩ  [R0603]  63.99 14.48 180 top
R16  330Ω  [R0603]  67.31 11.68 180 top
R17  10kΩ  [R0603]  64.01 11.56 180 top
R18  82kΩ  [R0603]  69.72 48.37 270 top
R19  4.7kΩ  [R0603]  6.1 43.05 0 top
R20  4.7kΩ  [R0603]  6.03 46.14 0 top
SHT  HX PH254-01-04-Z-L11.5 straight pin header  [HDR-TH_4P-HX-PH254-01-04-Z-L11.5]  3.05 24.13 90 top
U1  ESP32-DEVKITC-VE  [BULETM-SMD_ESP32-DEVKITC]  52.7 40.77 90 top
U2  AMS1117-5.0  [SOT-223_L6.5-W3.5-P2.30-LS7.0-BR]  24.64 47.5 180 top
VEML  2.54-1*5  [HDR-TH_5P-P2.54-V-M]  2.92 42.04 90 top
VIN  DB301V-3.5-2P-GN-S  [CONN-TH_DB301V-3.5-2P-GN]  22.99 63.5 180 top

## Footprints (pads in the part's own frame, mm; a bottom-side part is the same pattern mirrored in y, then rotated)
BULETM-SMD_ESP32-DEVKITC
  round 1.5 hole 1: 1(-22.86,-12.7) 2(-20.32,-12.7) 3(-17.78,-12.7) 4(-15.24,-12.7) 5(-12.7,-12.7) 6(-10.16,-12.7) 7(-7.62,-12.7) 8(-5.08,-12.7) 9(-2.54,-12.7) 10(0,-12.7) 11(2.54,-12.7) 12(5.08,-12.7) 13(7.62,-12.7) 14(10.16,-12.7) 15(12.7,-12.7) 16(15.24,-12.7) 17(17.78,-12.7) 18(20.32,-12.7) 19(22.86,-12.7) 20(-22.86,12.7) 21(-20.32,12.7) 22(-17.78,12.7) 23(-15.24,12.7) 24(-12.7,12.7) 25(-10.16,12.7) 26(-7.62,12.7) 27(-5.08,12.7) 28(-2.54,12.7) 29(0,12.7) 30(2.54,12.7) 31(5.08,12.7) 32(7.62,12.7) 33(10.16,12.7) 34(12.7,12.7) 35(15.24,12.7) 36(17.78,12.7) 37(20.32,12.7) 38(22.86,12.7)
C1206
  rect 1.485x1.728 smd: 1(-1.593,0) 2(1.593,0)
CONN-TH_4P-P2.54_0470531000
  round 1.72 hole 1.02: 1(-3.81,0) 2(-1.27,0) 3(1.27,0) 4(3.81,0)
CONN-TH_DB125-2.54-3P-GN
  rect 2x2 hole 1.4: 1(-2.54,0)
  round 2 hole 1.4: 2(0,0) 3(2.54,0)
CONN-TH_DB301V-3.5-2P-GN
  round 1.8 hole 1.1: 1(-1.75,0) 2(1.75,0)
DC-IN-TH_DC005
  oval 2x4.6 hole 1.2x3.7: 1(3.1,2.35) 2(-3.1,2.35)
  oval 4.6x2 hole 3.7x1.2: 3(0.1,-2.35)
FUSE-TH_L24.8-W9.8-P22.60
  round 3 hole 2: 1(-11.3,0) 2(11.3,0)
HDR-TH_2P-P2.54-V-M
  rect 2x2 hole 1.2: 1(-1.27,0)
  round 2 hole 1.2: 2(1.27,0)
HDR-TH_3P-P2.54-V-M-1
  rect 1.575x1.8 hole 1.2: 1(-2.54,0)
  round 1.8 hole 1.2: 2(0,0) 3(2.54,0)
HDR-TH_4P-HX-PH254-01-04-Z-L11.5
  rect 1.62x1.62 hole 1.02: 1(-3.81,0)
  round 1.62 hole 1.02: 2(-1.27,0) 3(1.27,0) 4(3.81,0)
HDR-TH_5P-P2.54-V-M
  rect 1.7x1.7 hole 1.1: 1(-5.08,0)
  round 1.7 hole 1.1: 2(-2.54,0) 3(0,0) 4(2.54,0) 5(5.08,0)
HDR-TH_6P-P2.54-V-M
  rect 1.7x1.7 hole 1.1: 1(-6.35,0)
  round 1.7 hole 1.1: 2(-3.81,0) 3(-1.27,0) 4(1.27,0) 5(3.81,0) 6(6.35,0)
L0603
  rect 0.8x0.864 smd: 1(-0.7,0) 2(0.7,0)
M3_MOUNTING_HOLE_REGULAR
  round 0.8 hole 0.35: 1(-3,0) 1(0,3) 1(0,-3) 1(3,0)
  round 8 hole 3.5: 1(0,0)
R0603
  rect 0.806x0.864 smd: 1(-0.753,0) 2(0.753,0)
SMA_L4.3-W2.6-LS5.2-RD
  rect 2x2 smd: 1(-2.2,0) 2(2.2,0)
SOT-23-3_L2.9-W1.3-P1.90-LS2.4-BR
  rect 1.25x0.7 smd: 1(1,-0.95) 2(1,0.95) 3(-1,0)
SOT-223_L6.5-W3.5-P2.30-LS7.0-BR
  rect 2.465x1.05 smd: 1(2.857,-2.3) 2(2.857,0) 3(2.857,2.3)
  rect 2.465x3.54 smd: 4(-2.857,0)

## Nets
As in the schematic.

Pads without a net: MH1 1; MH2 1; MH3 1; MH4 1; U1 2 12 13 15 16 17 18 23 24 29 30 31 33 34 36 37 38; VEML 2

## Via types
v1: diameter 0.61, hole 0.305, Top Layer to Bottom Layer, 114 vias
v2: diameter 1.016, hole 0.61, Top Layer to Bottom Layer, 1 via
v3: diameter 1.27, hole 0.61, Top Layer to Bottom Layer, 1 via

## Routing (per net, layer and track width the routed paths; a pad name or vN(x,y) marks a point on that pad's centre or on a via; arc(x,y) is an arc through that point)
+3V3: length 165
  Top Layer w0.5: 37.56,6.7 40.39,9.53 R9.2 40.46,12 R10.2 ; H1.5 68.71,21.96 67.45,20.71 67.45,19.96 U1.1 ; v1(20.07,30.1) 20.45,29.72 22.48,29.72 ; 37.56,3.96 DIO1.2 ; v1(5.97,41.15) 6.85,42.03 R19.2 6.79,43.12 R20.2
  Top Layer w0.762: DIO1.2 39.19,2.03 45.76,2.03 46.53,2.79 46.53,2.88 ; 46.53,2.88 DIO2.2 ; 46.53,2.88 47.37,2.03 54.22,2.03 55.49,3.31 ; DIO4.2 64.46,2.74 63.75,2.03 56.77,2.03 55.49,3.31 ; 55.49,3.31 DIO3.2
  Top Layer w1.016: 37.56,3.96 37.56,17.41 v3(37.63,17.48) ; 28.07,29.72 22.48,29.72 16.89,24.13 16.89,21.72 14.48,19.3 10.96,19.3 9.94,20.32 SHT.1 ; I2C1.1 31.48,29.72 I2C2.1 ; U1.1 60.71,17.91 55.49,12.7 DIO3.2
  Bottom Layer w0.5: v1(20.07,30.1) 19.81,29.84 5.97,29.84 5.59,30.23 5.59,40.77 v1(5.97,41.15)
  Bottom Layer w1.016: I2C2.1 31.5,26.32 37.63,20.18 v3(37.63,17.48)
+5V: length 130.5
  Top Layer w0.5: 69.47,37.71 71.36,37.71 72.26,38.61 72.26,48.48 70.81,49.93 69.58,49.93 66.8,52.7 66.8,62.23 U1.19
  Top Layer w0.762: 29.72,45.08 v1(33.91,45.08)
  Top Layer w1.016: 3.56,37.08 13.84,37.08 16.64,39.88 16.64,44.2 19.94,47.5 U2.2 ; U2.4 27.61,47.38 C3.2
  Top Layer w2.032: 19.33,47.5 U2.2 U2.4 ; U2.4 27.5,50.49 ; U2.4 29.97,47.5
  Bottom Layer w1.016: U1.19 42.42,63.63 40.64,65.4 38.99,65.4 37.26,63.68 37.26,52.37 36.07,51.18 32.08,51.18 v1(31.24,50.34) 31.24,49.01 v1(31.5,48.76) 5V.2
  vias: v1(18.54,46.3) v1(18.67,49.15) v1(19.56,43.05) v1(20.32,51.18) v1(24,51.56) v1(24.32,48.92) v1(24.32,46.55) v1(24.89,43.05) v1(25.68,45.21) v1(29.46,49.97) v1(29.46,45.21) v1(29.64,43.05) v1(33.85,48.76) v1(34.04,51.11)
GND: length 520.5
  Top Layer w0.5: v1(67.06,22.61) 66.17,21.72 v1(62.86,21.72) 60.83,23.75 v1(55.88,23.75) ; C7.1 82.6,39.62 82.8,39.42 ; v1(71.37,46.1) v1(71.37,48.16) 71.37,48.51 70.77,49.12 R18.1 69.68,49.08 L2.1 ; H1.6 66.56,18.04 66.56,17.43 65.88,16.75 65.27,16.75 64.77,16.26 v1(61.98,16.26) ; v1(69.6,36.45) 70.74,36.45 v1(71.3,35.88) 71.07,35.65 v1(71.07,32.51) ; v1(61.98,16.26) 61.09,16.26 58.8,13.97 v1(58.8,11.68) ; v1(61.98,16.26) 63.24,14.99 R15.2 ; v1(6.62,30.92) 8.05,30.92 v1(10.91,28.07) ; 25.34,62.9 C4.1 ; Q4.2 31.19,13.9 R8.1 ; Q3.2 23.7,13.9 R7.1
  Top Layer w0.508: v1(7.11,38.35) 6.6,38.35 VEML.3 ; 82.79,29.81 82.75,29.77 D2.2 ; R17.2 62.87,11.56 62.75,11.43 v1(61.85,11.43) 61.85,3.74 DIO4.1 ; 82.71,40.13 82.8,40.22
  Top Layer w1.016: 29.59,16.51 29.59,14.22 ; 27.85,59.31 30.61,59.31 28.07,56.77 28.07,56.54 28.6,56.54 31.24,59.18 ; 36.58,34.29 38.86,34.29 U1.26 ; I2C2.2 31.48,32.26 I2C1.2 26.67,33.78 D1.2 23.92,36.98 C2.1 23.06,40.64 C1.1 27.55,40.77 C3.1 ; 36.32,40.51 33.4,40.51 31.5,42.42 31.5,43.31 ; U1.14 46.85,50.93 v1(46.1,50.18) ; U1.20 41.66,17.91 46.1,22.35 v1(46.1,50.18) ; v1(46.1,50.18) 43.69,52.59 v1(43.69,62.36) 43.05,63 43.05,65.15 42.93,65.28 38.23,65.28 37.21,64.26 37.21,57.87 v1(35.31,55.96) ; 22.08,14.35 21.95,14.48 21.95,15.66 23.18,16.89 v1(29.72,16.89) ; 27.18,54.82 23.96,54.82 v1(22.94,53.8) 21.78,52.64 U2.1
  Top Layer w1.27: CN1.4 82.8,43.75 82.8,35.62 82.49,35.31 82.79,35.31 82.79,24.94 CN3.4
  Top Layer w1.524: v1(29.72,16.89) 31.83,19.01 v2(35.86,19.01)
  Top Layer w2.032: 32.65,59.55 32.7,59.59 32.7,61.09 ; DC1.2 32.7,56.07 32.64,56.01 ; DIO1.1 35.02,7.23 v1(35.56,7.78) v1(35.56,14.43) 35.56,18.71 v2(35.86,19.01) 36.58,19.73 36.58,54.69 v1(35.31,55.96) 28.32,55.96 27.18,54.82 27.18,61.06 VIN.1
  Bottom Layer w0.5: H1.1 69.09,32.51 v1(71.07,32.51) ; v1(48.77,18.29) 47.88,18.29 v1(45.97,20.19) ; v1(63.75,32.13) 63.75,32.26 v1(61.98,34.04) ; 71.37,44.7 71.37,39.59 v1(71.21,39.43) 69.6,37.81 v1(69.6,36.45) ; 71.37,44.7 v1(73.28,42.8) ; 71.37,44.7 v1(71.37,46.1) ; H1.6 68.71,20.95 v1(67.06,22.61) ; v1(6.62,30.92) 6.62,37.87 v1(7.11,38.35) ; v1(58.8,11.68) 61.59,11.68 v1(61.85,11.43) ; v1(53.21,24.89) 54.74,24.89 v1(55.88,23.75)
  Bottom Layer w0.762: v1(69.97,1.65) 63.94,1.65 DIO4.1 59.65,1.4 v1(55.77,1.4) 55.22,1.4 DIO3.1 50.69,1.4 46.25,1.4 DIO2.1 41.84,1.52 37.16,1.52 DIO1.1
  Bottom Layer w1.016: 26.54,56.08 28.07,56.08 28.07,53.99 ; 26.54,56.08 26.54,58.2 28.02,59.55 35.58,59.55 35.81,59.31 35.81,56.47 v1(35.31,55.96) 32.72,55.96 32.64,55.88 ; 30.17,58.87 30.28,58.87 30.99,58.17 34.42,58.17 34.42,58.42 35.18,59.18 34.04,60.32 34.04,60.71 30.86,60.71 30.48,60.32 ; 32.7,61.09 29.43,61.09 28.07,59.72 28.07,55.96 32.58,55.96 32.7,55.84 32.7,61.09 ; 32.7,61.09 34.54,61.09 35.83,59.8 ; 21.72,28.07 v1(10.91,28.07) 8.25,28.07 SHT.2 ; 21.72,28.07 22.23,28.07 26.42,32.26 I2C1.2 ; 21.72,28.07 v1(24.46,25.32) ; 26.8,57.53 27.22,53.72 28.83,53.72 29.08,53.97 29.08,58.42 28.96,58.55 27.81,58.55 26.8,57.53
  Bottom Layer w2.794: VIN.1 29,59.23 DC1.2
  vias: v1(3.94,62.99) v1(4.57,4.06) v1(5.71,18.41) v1(9.02,22.1) v1(14.35,40.77) v1(14.86,18.16) v1(15.11,6.22) v1(15.24,24.13) v1(16.51,30.99) v1(16.64,38.1) v1(16.89,47.75) v1(18.03,20.32) v1(18.42,54.86) v1(19.43,31.75) v1(20.57,1.75) v1(20.83,35.81) v1(21.34,41.43) v1(28.5,2.03) v1(29.59,14.94) v1(29.84,38.88) v1(29.84,36.19) v1(29.84,33.78) v1(29.97,7.75) v1(33.53,25.65) v1(35.56,27.43) v1(36.2,65.03) v1(37.59,31.37) v1(37.72,29.08) v1(38.73,9.14) v1(42.29,49.4) v1(42.46,34.67) v1(43.43,47.37) v1(43.98,65.25) v1(44.07,8) v1(56.26,44.7) v1(57.28,16.45) v1(57.28,11.94) v1(58.67,46.35) v1(59.69,62.2) v1(61.21,65.28) v1(62.99,43.05) v1(63.88,59.56) v1(67.95,61.98) v1(67.95,53.59) v1(67.95,10.41) v1(71.5,20.19) v1(71.83,34.05) v1(72.26,49.66) v1(73.08,27.24) v1(74.8,22.48) v1(75.18,41.27) v1(75.76,36.39) v1(75.88,26.95) v1(78.17,29.06) v1(79.5,16.83) v1(81.41,63.37) v1(81.53,3.94)
VIN: length 187.7
  Top Layer w0.5: 17.91,37.64 18.11,37.85 C2.2 ; 17.91,33.55 19.29,33.55 19.52,33.78 ; C7.2 78.04,37.28 79.44,35.88 CN2.3 79.44,31.94 77.27,29.77 D2.1 ; 17.91,40.69 17.99,40.77 C1.2
  Top Layer w0.508: C1.2 19.74,34.1 19.81,34.04
  Top Layer w0.762: C6.2 28.19,8.06 28.19,5.84 29.74,4.3 P2.2 ; C5.2 23.12,7.37 21.56,5.81 P1.2
  Top Layer w1.016: U2.3 19.54,45.2 17.91,43.56 17.91,29.97 13.08,25.15 FH1.2
  Bottom Layer w1.27: CN3.3 CN2.3 CN1.3
  Bottom Layer w1.778: 21.84,12.7 23.62,10.92 24.26,10.92 24.59,11.25 40.97,11.25 43.81,14.1 70.87,14.1 74.3,17.53 78.3,17.53 78.94,18.17 79.01,18.17 79.44,18.61 CN3.3
  Bottom Layer w2.032: 21.56,6.89 21.56,14 FH1.2 ; 21.56,6.89 26.77,6.89 29.74,3.92 P2.2 ; 21.56,6.89 P1.2
VIN_U: length 44.7
  Top Layer w0.5: 19.89,58.67 19.89,58.67 C4.2
  Top Layer w2.032: FH1.1 13.08,46.35 19.89,53.16 19.89,62.15 VIN.2
  Bottom Layer w2.032: VIN.2 21.24,61.95 24.64,58.55 24.64,53.59 26.41,51.82 29.85,51.82 31.06,53.03 DC1.1
DI_AMS: length 36.3
  Top Layer w0.254: U1.5 66.42,29.08 66.42,30.17 66.43,30.18 66.43,31.03 66.42,31.05 66.42,32.71 66.43,32.72 66.43,41.26 65.42,42.28 64.98,42.28 62.86,44.4 62.16,44.4 61.98,44.58 61.98,45.59 62.23,45.85 63.88,45.85 64.9,46.86 64.97,46.86 64.98,46.88 65.83,46.88 65.84,46.86 66.29,46.86 66.93,46.23 66.93,44.58 AMS312.2 70.23,44.07 70.23,46.35 69.72,46.86 R18.2
DIO1S: length 45.5
  Top Layer w0.508: R9.1 v1(41.9,9.9) 38.86,6.86 38.86,4.9 DIO1.3 ; v1(43.81,11.68) 43.81,15.62 51.21,23.01 53.59,23.01 63.73,33.15 U1.7
  Bottom Layer w0.508: v1(43.81,11.68) 43.69,11.68 v1(41.9,9.9)
DIO2S: length 50
  Top Layer w0.508: 43.05,15.24 43.05,14.35 ; 43.05,15.24 42.42,14.6 ; 43.05,15.24 43.05,15.87 50.93,23.75 53.34,23.75 63.5,33.91 64.26,33.91 65.4,35.05 U1.8 ; 43.05,14.35 43.05,7.62 44.32,6.35 48.13,6.35 49.07,5.42 DIO2.3 ; 43.05,14.35 42.8,14.6 R10.1
DIO3S: length 35.7
  Top Layer w0.508: R11.1 68.33,14.75 v1(68.33,16.51) ; v1(44.83,22.61) 42.67,20.45 40,20.45
  Bottom Layer w0.508: v1(44.83,22.61) 63.63,22.61 64.52,21.72 66.18,21.72 66.67,21.22 66.67,18.16 v1(68.33,16.51)
DIO4S: length 68.9
  Top Layer w0.508: v1(62.67,45.17) 63.92,45.17 64.5,44.59 65.88,44.59 66.93,43.54 66.93,36.94 70.1,33.77 70.1,13.33 68.45,11.68 68.11,11.68
  Bottom Layer w0.508: v1(62.67,45.17) 62.64,45.21 58.29,45.21 54.36,49.15 44.07,49.15 42.8,50.42 42.8,54.86 41.66,56.01 U1.35
EXP2: length 3.4
  Bottom Layer w0.508: H1.2 68.45,30.61 U1.6
EXP3: length 6.2
  Bottom Layer w0.508: U1.3 67.45,25.03 67.45,25.79 68.71,27.05 H1.3
EXP4: length 3.4
  Top Layer w0.508: 65.4,25.53 68.45,25.53 H1.4
FAN_FB1: length 17.3
  Bottom Layer w0.254: CN1.2 72.64,40.32 72.64,38.48 69.85,35.69 67.95,35.69 U1.9
FAN_FB2: length 19.9
  Bottom Layer w0.254: U1.10 64.39,40.77 64.01,40.39 64.01,37.59 64.64,36.96 65.79,36.96 67.69,35.05 71.95,35.05 73.98,33.02 74.8,33.02 76.58,34.8 CN2.2
FAN_FB3: length 29.7
  Bottom Layer w0.254: CN3.2 76.45,24.13 75.12,25.46 75.12,29.67 70.12,34.67 65.84,34.67 65.83,34.66 64.66,34.66 63.63,35.69 63.63,40.77 64.66,41.8 65.36,41.8 65.91,42.35 65.91,42.8 65.4,43.31
FAN_PWM: length 59
  Top Layer w0.254: CN1.1 CN2.1
  Top Layer w0.61: CN2.1 CN3.1
  Bottom Layer w0.508: CN1.1 71.93,47 64.7,47 63.39,45.69 63.39,44.88 62.97,44.46 57.93,44.46 54,48.39 40,48.39
P1P: length 16.3
  Top Layer w0.762: Q3.3 18.42,12.95 ; Q3.3 20.08,14.34 ; Q3.3 20.08,10.11 C5.1 19.93,6.85 18.06,4.98 P1.1
  Top Layer w1.016: 16.74,2.67 19.43,2.67 19.56,2.79
P1S: length 41.3
  Top Layer w0.254: R5.1 25.78,13.71 v1(25.78,14.6)
  Bottom Layer w0.254: v1(25.78,14.6) 26.82,15.65 40.91,15.65 43.15,17.89 43.15,32.66 41.27,34.54 41.27,36.96 U1.28
P2P: length 18.8
  Top Layer w0.762: Q4.3 27.57,11.89 26.98,11.3 C6.1 26.98,5.77 26.24,5.03 P2.1
  Top Layer w1.016: P2.1 24.49,3.43 ; 26.67,3.43 27.43,2.67 ; C6.1 28.24,10.03 28.58,10.37
  Top Layer w1.524: 25.4,10.29 26.42,10.03 C6.1
  Top Layer w2.032: 27.57,11.89 27.57,14.46
P2S: length 33.3
  Top Layer w0.254: v1(32.58,16.64) 33.27,15.95 R6.1
  Bottom Layer w0.254: U1.27 40,35.18 42.8,32.38 42.8,18.03 40.77,16 33.22,16 v1(32.58,16.64)
SCL: length 76.5
  Top Layer w0.254: VEML.4 4.7,44.58 5.34,43.93 R19.1
  Bottom Layer w0.254: 2.48,26.6 3.43,26.6 3.23,26.4 2.81,26.4 2.74,26.34 ; 3.05,26.03 SHT.3 ; 3.05,26.03 1.65,27.43 1.65,28.45 2.41,29.21 4.12,29.21 4.7,29.79 4.7,43.94 4.06,44.58 3.05,44.58 ; 3.05,26.03 3.05,26.22 5.66,28.83 21.72,28.83 27.69,34.8 I2C1.3 31.48,34.8 I2C2.3 36.58,29.73 36.58,25.78 39.37,22.99 U1.22
SDA: length 70.2
  Top Layer w0.254: VEML.5 3.9,46.14 R20.1
  Bottom Layer w0.254: 5.21,29.21 4.73,28.84 5.08,29.6 5.47,29.21 5.21,29.21 ; 5.21,29.21 21.34,29.21 26.8,34.67 26.8,36.83 27.3,37.34 I2C1.4 31.48,37.34 I2C2.4 31.5,36.35 32.58,35.26 32.58,34.47 36.96,30.1 39.5,30.1 U1.25 ; 5.21,29.21 5.08,29.34 5.08,44.07 3.05,46.1 3.05,47.12 ; 5.21,29.21 5.1,29.21 3.83,27.94 SHT.4
$2N2877: length 16.7
  Top Layer w0.508: DIO3.3 60.58,6.21 60.58,11.94 61.98,13.33 64.24,13.33 64.74,13.84 R15.1 R11.2
$2N3321: length 9.9
  Top Layer w0.508: R17.1 66.56,11.56 66.56,4.11 DIO4.3
$2N5972: length 2.7
  Top Layer w0.254: AMS312.1 68.83,39.24 68.07,38.48 L1.2
$2N6228: length 2.8
  Top Layer w0.254: AMS312.3 68.83,46.23 68.02,47.04 L2.2
$4N422: length 3.8
  Top Layer w0.254: R5.2 R7.2 23.7,12 Q3.1
$4N423: length 3.8
  Top Layer w0.254: Q4.1 31.19,12 R8.2 R6.2

## Copper pours and planes (outline as drawn; the poured copper is in the pictures)
+5V on Top Layer: 17.91,49.4 17.91,44.63 18.8,42.16 30.54,42.16 31.11,42.74 34.74,42.74 35.18,43.18 35.18,51.69 34.67,52.2 20.7,52.2
+5V on Bottom Layer: 17.91,49.4 17.91,44.63 20.37,42.16 30.54,42.16 32.77,44.39 34.49,44.39 34.8,44.7 34.8,51.65 28.41,52.2 20.7,52.2
GND on Top Layer: 0.63,66.17 84.58,66.17 84.58,0.76 0.63,0.76
GND on Top Layer: 20.33,65.65 20.33,52.84 20.19,52.7 37.34,52.7 37.59,52.96 37.59,65.66 20.34,65.66
GND on Top Layer: 0.89,16.89 83.95,16.89 84.07,16.76 84.07,4.83 80.26,1.02 5.25,1.02 1.03,5.24 0.91,5.24 0.89,5.25
GND on Bottom Layer: 0.89,16.89 83.95,16.89 84.07,16.76 84.07,4.83 80.26,1.02 5.25,1.02 1.03,5.24 0.91,5.24 0.89,5.25
GND on Bottom Layer: 22.9,65.57 22.9,62.66 22.73,62.48 22.73,56.01 26.03,52.7 34.42,52.7 35.56,51.56 38.1,54.1 38.1,65.66 22.99,65.66
GND on Bottom Layer: 0.63,66.17 84.58,66.17 84.58,0.76 0.63,0.76
P1P on Top Layer: 16.13,15.37 20.74,15.37 21.08,15.11 21.08,11.43 22.48,10.03 22.48,7.75 20.95,6.22 20.95,3.98 19.74,2.1 16.13,2.1
P2P on Top Layer: 28.92,16.32 29.08,15.87 29.08,11.24 29.21,10.74 29.21,9.91 27.69,8.38 27.69,5.33 28.7,4.32 28.7,3.24 27.43,1.91 22.48,1.91 22.1,2.29 22.1,6.1 23.49,7.49 23.49,10.81 26.45,11.57 26.47,15.78 26.7,16.32

## Text on the board
Bottom Silkscreen Layer: EXP4 | EXP3 | EXP2 | GND | Simon van der Marel / 20260214 | S | 5V | 3V3 | DIO | PWM | FB | VIN | SHT40 | NC | SCL | SDA | VEML7700 | SW | I2C | JLCJLCJLCJLC | AMS312 | Designed as an / ESPHOME project
Top Silkscreen Layer: GND | SDA | SCL | NC | 5V | 3V3 | Do not / reverse | 12V | DIO | PWM | FB | VIN | S | SW | PLACE HERE: | ESP32 DEVKIT
